# EAGLE design p128necontrol (EAGLE 9.6.2)
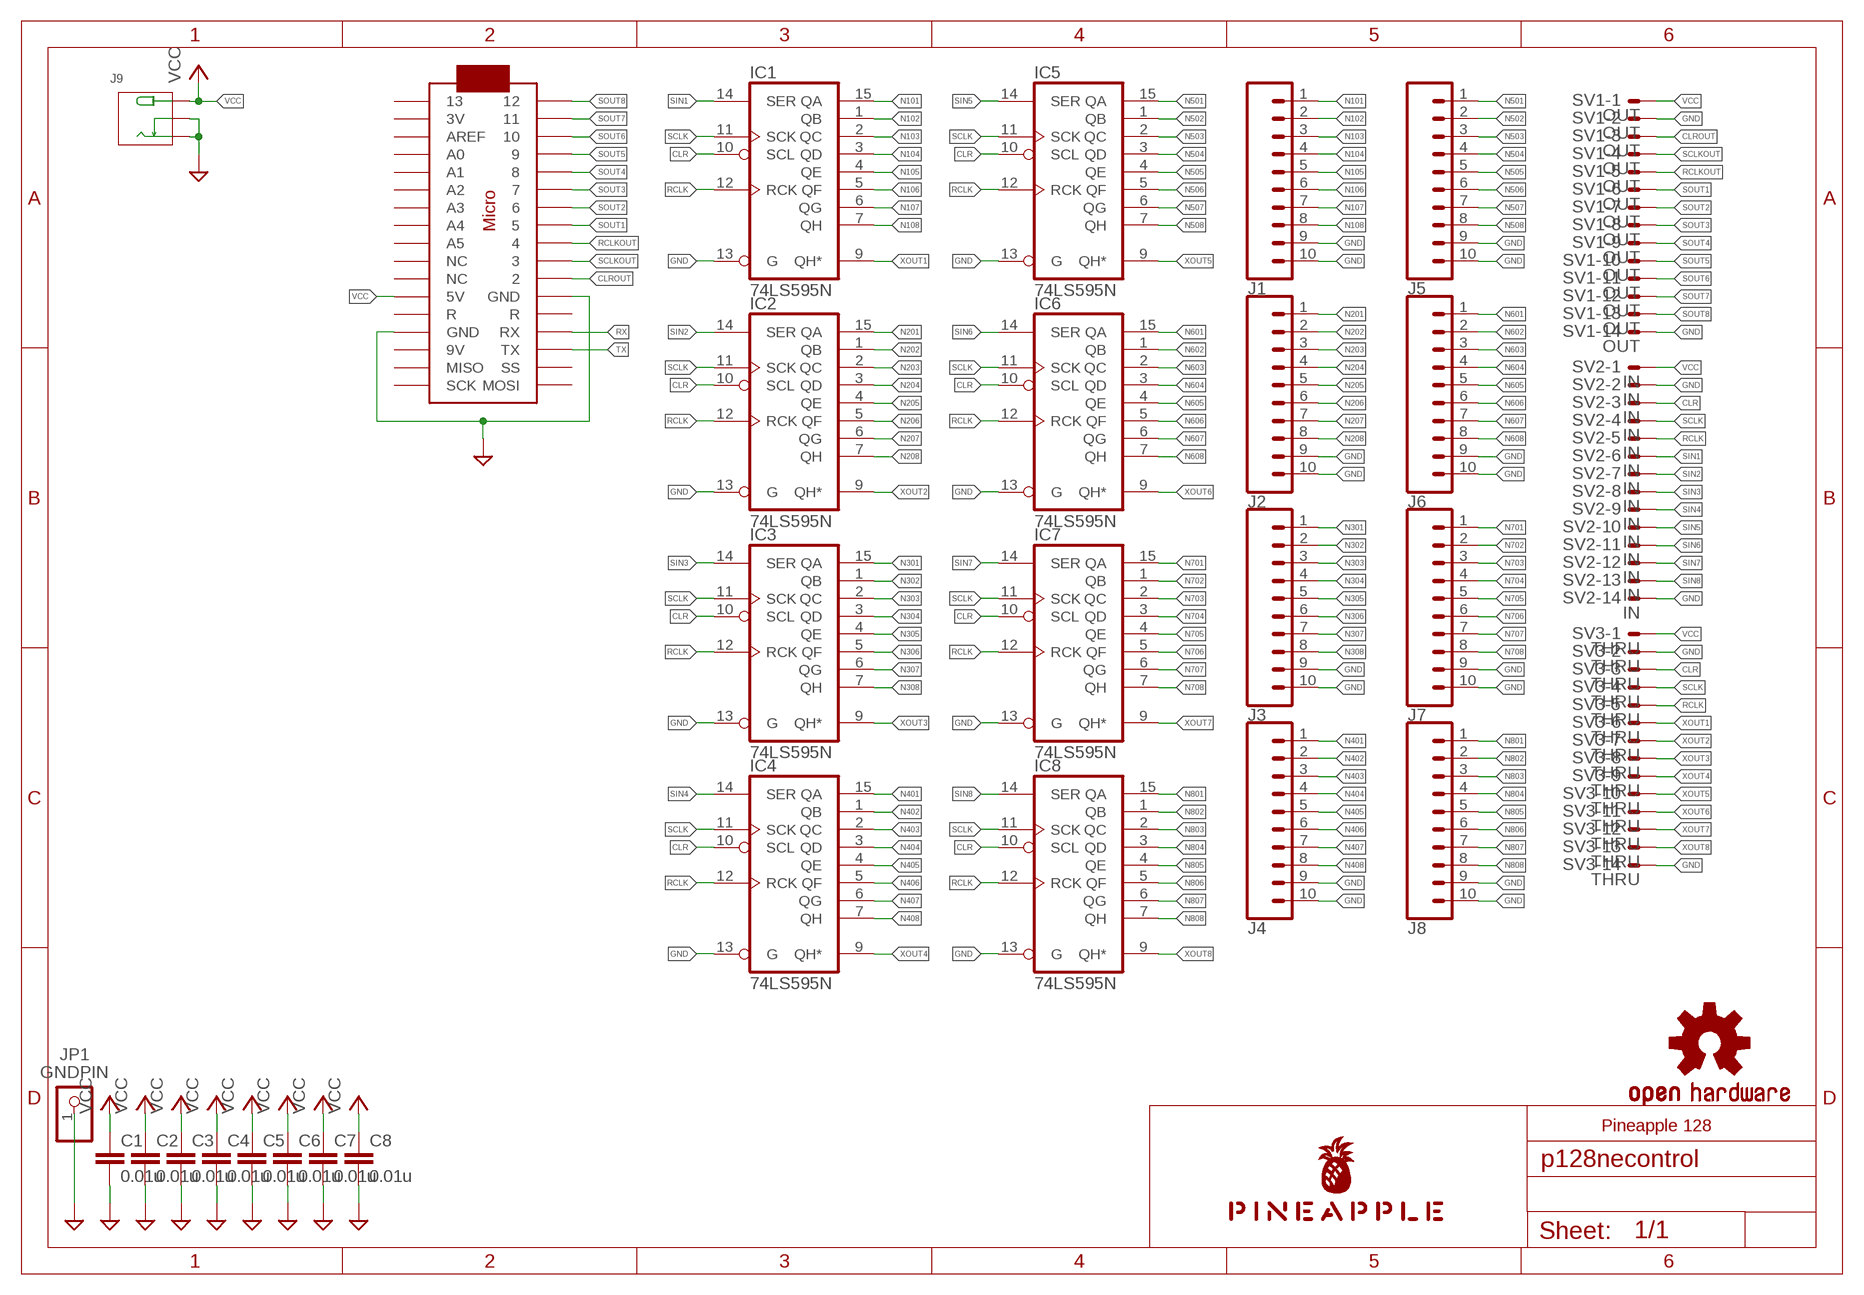
[diagram p0: schematic, sheet 1]

## Parts
C1  0.01u  C-EU025-024X044  [C025-024X044]
C2  0.01u  C-EU025-024X044  [C025-024X044]
C3  0.01u  C-EU025-024X044  [C025-024X044]
C4  0.01u  C-EU025-024X044  [C025-024X044]
C5  0.01u  C-EU025-024X044  [C025-024X044]
C6  0.01u  C-EU025-024X044  [C025-024X044]
C7  0.01u  C-EU025-024X044  [C025-024X044]
C8  0.01u  C-EU025-024X044  [C025-024X044]
IC1  74LS595N  [DIL16]
IC2  74LS595N  [DIL16]
IC3  74LS595N  [DIL16]
IC4  74LS595N  [DIL16]
IC5  74LS595N  [DIL16]
IC6  74LS595N  [DIL16]
IC7  74LS595N  [DIL16]
IC8  74LS595N  [DIL16]
J1  CONN_10"  [1X10]
J2  CONN_10"  [1X10]
J3  CONN_10"  [1X10]
J4  CONN_10"  [1X10]
J5  CONN_10"  [1X10]
J6  CONN_10"  [1X10]
J7  CONN_10"  [1X10]
J8  CONN_10"  [1X10]
J9  JACK-DC-005'DC-005'  [3P-L14.2*W11.0*H9.0MM]
JP1  GNDPIN  PINHD-1X1  [1X01]
LOGO1  OSHW-LOGOS-COPPER  [OSHW-LOGO-S_COPPER]
SV1  OUT  ML14E  [ML14]
SV2  IN  ML14E  [ML14]
SV3  THRU  ML14E  [ML14]
U$1  PINEAPPLE450_SILK  [PINEAPPLE450_SILK]
U$2  ARDUINOMICRO  [ARDUINOMICRO]

## Nets
CLR: IC1.10(SCL) IC2.10(SCL) IC3.10(SCL) IC4.10(SCL) IC5.10(SCL) IC6.10(SCL) IC7.10(SCL) IC8.10(SCL) SV2.3 SV3.3
CLROUT: SV1.3 U$2.P$11
GND [gnd]: C1.2 C2.2 C3.2 C4.2 C5.2 C6.2 C7.2 C8.2 IC1.13(G) IC2.13(G) IC3.13(G) IC4.13(G) IC5.13(G) IC6.13(G) IC7.13(G) IC8.13(G) J1.9 J1.10 J2.9 J2.10 J3.9 J3.10 J4.9 J4.10 J5.9 J5.10 J6.9 J6.10 J7.9 J7.10 J8.9 J8.10 J9.-1(-) J9.-2(CDN) JP1.1 SV1.2 SV1.14 SV2.2 SV2.14 SV3.2 SV3.14 U$2.P$12(GND) U$2.P$21(GND)
N101: IC1.15(QA) J1.1
N102: IC1.1(QB) J1.2
N103: IC1.2(QC) J1.3
N104: IC1.3(QD) J1.4
N105: IC1.4(QE) J1.5
N106: IC1.5(QF) J1.6
N107: IC1.6(QG) J1.7
N108: IC1.7(QH) J1.8
N201: IC2.15(QA) J2.1
N202: IC2.1(QB) J2.2
N203: IC2.2(QC) J2.3
N204: IC2.3(QD) J2.4
N205: IC2.4(QE) J2.5
N206: IC2.5(QF) J2.6
N207: IC2.6(QG) J2.7
N208: IC2.7(QH) J2.8
N301: IC3.15(QA) J3.1
N302: IC3.1(QB) J3.2
N303: IC3.2(QC) J3.3
N304: IC3.3(QD) J3.4
N305: IC3.4(QE) J3.5
N306: IC3.5(QF) J3.6
N307: IC3.6(QG) J3.7
N308: IC3.7(QH) J3.8
N401: IC4.15(QA) J4.1
N402: IC4.1(QB) J4.2
N403: IC4.2(QC) J4.3
N404: IC4.3(QD) J4.4
N405: IC4.4(QE) J4.5
N406: IC4.5(QF) J4.6
N407: IC4.6(QG) J4.7
N408: IC4.7(QH) J4.8
N501: IC5.15(QA) J5.1
N502: IC5.1(QB) J5.2
N503: IC5.2(QC) J5.3
N504: IC5.3(QD) J5.4
N505: IC5.4(QE) J5.5
N506: IC5.5(QF) J5.6
N507: IC5.6(QG) J5.7
N508: IC5.7(QH) J5.8
N601: IC6.15(QA) J6.1
N602: IC6.1(QB) J6.2
N603: IC6.2(QC) J6.3
N604: IC6.3(QD) J6.4
N605: IC6.4(QE) J6.5
N606: IC6.5(QF) J6.6
N607: IC6.6(QG) J6.7
N608: IC6.7(QH) J6.8
N701: IC7.15(QA) J7.1
N702: IC7.1(QB) J7.2
N703: IC7.2(QC) J7.3
N704: IC7.3(QD) J7.4
N705: IC7.4(QE) J7.5
N706: IC7.5(QF) J7.6
N707: IC7.6(QG) J7.7
N708: IC7.7(QH) J7.8
N801: IC8.15(QA) J8.1
N802: IC8.1(QB) J8.2
N803: IC8.2(QC) J8.3
N804: IC8.3(QD) J8.4
N805: IC8.4(QE) J8.5
N806: IC8.5(QF) J8.6
N807: IC8.6(QG) J8.7
N808: IC8.7(QH) J8.8
RCLK: IC1.12(RCK) IC2.12(RCK) IC3.12(RCK) IC4.12(RCK) IC5.12(RCK) IC6.12(RCK) IC7.12(RCK) IC8.12(RCK) SV2.5 SV3.5
RCLKOUT: SV1.5 U$2.P$9
RX: U$2.P$14(RX)
SCLK: IC1.11(SCK) IC2.11(SCK) IC3.11(SCK) IC4.11(SCK) IC5.11(SCK) IC6.11(SCK) IC7.11(SCK) IC8.11(SCK) SV2.4 SV3.4
SCLKOUT: SV1.4 U$2.P$10
SIN1: IC1.14(SER) SV2.6
SIN2: IC2.14(SER) SV2.7
SIN3: IC3.14(SER) SV2.8
SIN4: IC4.14(SER) SV2.9
SIN5: IC5.14(SER) SV2.10
SIN6: IC6.14(SER) SV2.11
SIN7: IC7.14(SER) SV2.12
SIN8: IC8.14(SER) SV2.13
SOUT1: SV1.6 U$2.P$8
SOUT2: SV1.7 U$2.P$7
SOUT3: SV1.8 U$2.P$6
SOUT4: SV1.9 U$2.P$5
SOUT5: SV1.10 U$2.P$4
SOUT6: SV1.11 U$2.P$3
SOUT7: SV1.12 U$2.P$2
SOUT8: SV1.13 U$2.P$1
TX: U$2.P$15(TX)
VCC [power]: C1.1 C2.1 C3.1 C4.1 C5.1 C6.1 C7.1 C8.1 J9.+ SV1.1 SV2.1 SV3.1 U$2.P$23(5V)
XOUT1: IC1.9(QH*) SV3.6
XOUT2: IC2.9(QH*) SV3.7
XOUT3: IC3.9(QH*) SV3.8
XOUT4: IC4.9(QH*) SV3.9
XOUT5: IC5.9(QH*) SV3.10
XOUT6: IC6.9(QH*) SV3.11
XOUT7: IC7.9(QH*) SV3.12
XOUT8: IC8.9(QH*) SV3.13
Unconnected: U$2.P$13(R) U$2.P$16(SS) U$2.P$17(MOSI) U$2.P$18(SCK) U$2.P$19(MISO) U$2.P$20(9V) U$2.P$22(R) U$2.P$24(NC) U$2.P$25(NC) U$2.P$26(A5) U$2.P$27(A4) U$2.P$28(A3) U$2.P$29(A2) U$2.P$30(A1) U$2.P$31(A0) U$2.P$32(AREF) U$2.P$33(3V) U$2.P$34

## Notes on the sheet
- Pineapple 128

## Power pins joined to a net without a drawn wire
GND: IC1.8(GND) IC2.8(GND) IC3.8(GND) IC4.8(GND) IC5.8(GND) IC6.8(GND) IC7.8(GND) IC8.8(GND)
VCC: IC1.16(VCC) IC2.16(VCC) IC3.16(VCC) IC4.16(VCC) IC5.16(VCC) IC6.16(VCC) IC7.16(VCC) IC8.16(VCC)

## Library data of the parts
C1-C8 = resistor:C-EU: CAPACITOR, European symbol
IC1-IC8 = 74xx-us:74*595: 8-bit SHIFT REGISTER, output latch
J1-J8 = SparkFun-Connectors:CONN_10: Multi connection point. Often used as Generic Header-pin footprint for 0.1 inch spaced/style header connections On any of the 0.1 inch spaced packages, you can populate with these: Break Away Headers - Straight <https://www.sparkfun.com/products/116> (PRT-00116) Break Away Male Headers - Right Angle <https://www.sparkfun.com/products/553> (PRT-00553) Female Headers <https://www.sparkfun.com/products/115> (PRT-00115) Break Away Headers - Machine Pin <https://www.sparkfun.com/products/117> (PRT-00117) Break Away Female Headers - Swiss Machine Pin <https://www.sparkfun.com/products/743> (PRT-00743) Arduino Stackable Header - 10 Pin <https://www.sparkfun.com/products/11376> (PRT-11376) For SCREWTERMINALS and SPRING TERMINALS visit here: Screw Terimnals on SparkFun.com <https://www.sparkfun.com/search/results?term=Screw+Terminals> (5mm/3.5mm/2.54mm spacing) This device is also useful as a general connection point to wire up your design to another part of your project. Our various solder wires solder well into these plated through hole pads. Hook-Up Wire - Assortment (Stranded, 22 AWG) <https://www.sparkfun.com/products/11375> (PRT-11375) Hook-Up Wire - Assortment (Solid Core, 22 AWG) <https://www.sparkfun.com/products/11367> (PRT-11367) View the entire wire category on our website here <https://www.sparkfun.com/categories/141> Special notes: Molex polarized connector foot print use with SKU : PRT-08231 with associated crimp pins and housings. 1MM SMD Version SKU: PRT-10208 NOTES ON THE VARIANTS LOCK and LOCK_LONGPADS... This footprint was designed to help hold the alignment of a through-hole component (i.e. 6-pin header) while soldering it into place. You may notice that each hole has been shifted either up or down by 0.005 of an inch from it's more standard position (which is a perfectly straight line). This slight alteration caused the pins (the squares in the middle) to touch the edges of the holes. Because they are alternating, it causes a "brace" to hold the component in place. 0.005 has proven to be the perfect amount of "off-center" position when using our standard breakaway headers. Although looks a little odd when you look at the bare footprint, once you have a header in there, the alteration is very hard to notice. Also,if you push a header all the way into place, it is covered up entirely on the bottom side.; PROD_ID: CONN-11563
J9 = Seeed-Connector:JACK-DC-005: 320120003
JP1 = pinhead:PINHD-1X1: PIN HEADER
LOGO1 = SparkFun-Aesthetics:OSHW-LOGO: Open-Source Hardware (OSHW) Logo This logo indicates the piece of hardware it is found on incorporates a OSHW license and/or adheres to the definition of open source hardware found here: http://freedomdefined.org/OSHW
SV1-SV3 = con-ml:ML14E: HARTING; OC_FARNELL: unknown; OC_NEWARK: unknown
U$1 = pineapple:PINEAPPLE450_SILK
U$2 = adafruit:ARDUINOMICRO

## Net classes
0 default: width 0.152 mm, drill 0.152 mm, clearance 0.152 mm
1 gnd: width 0.305 mm, drill 0.152 mm, clearance 0.152 mm
2 power: width 0.305 mm, drill 0.152 mm, clearance 0.152 mm
3 analog: width 0.152 mm, drill 0.152 mm, clearance 0.152 mm

## Board
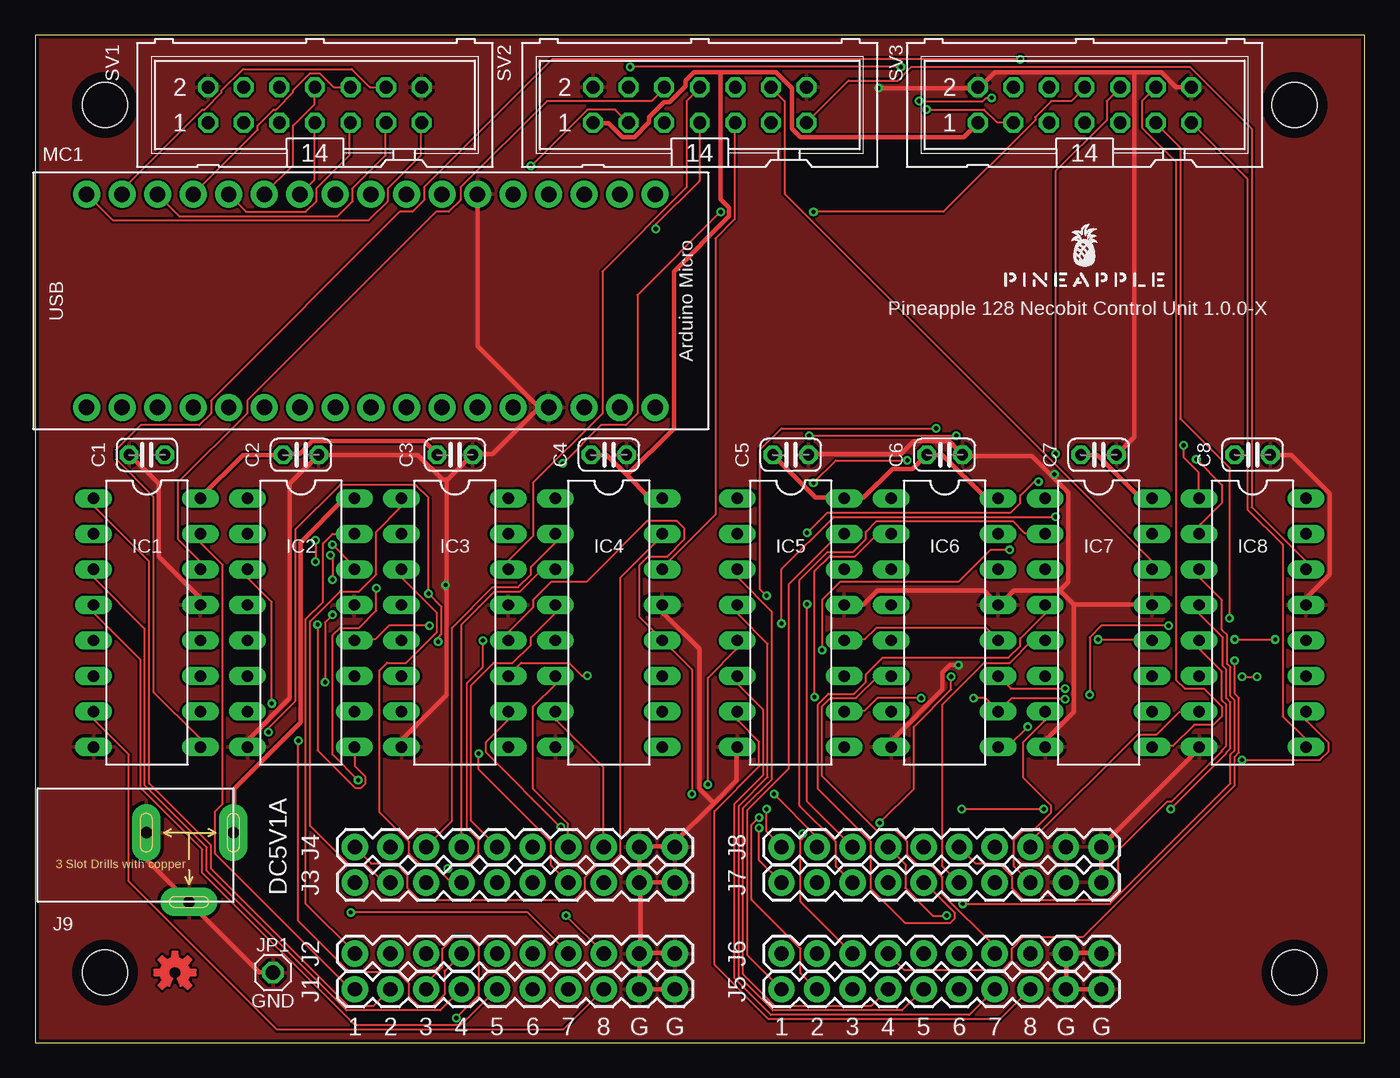
[diagram p1: board, top side]
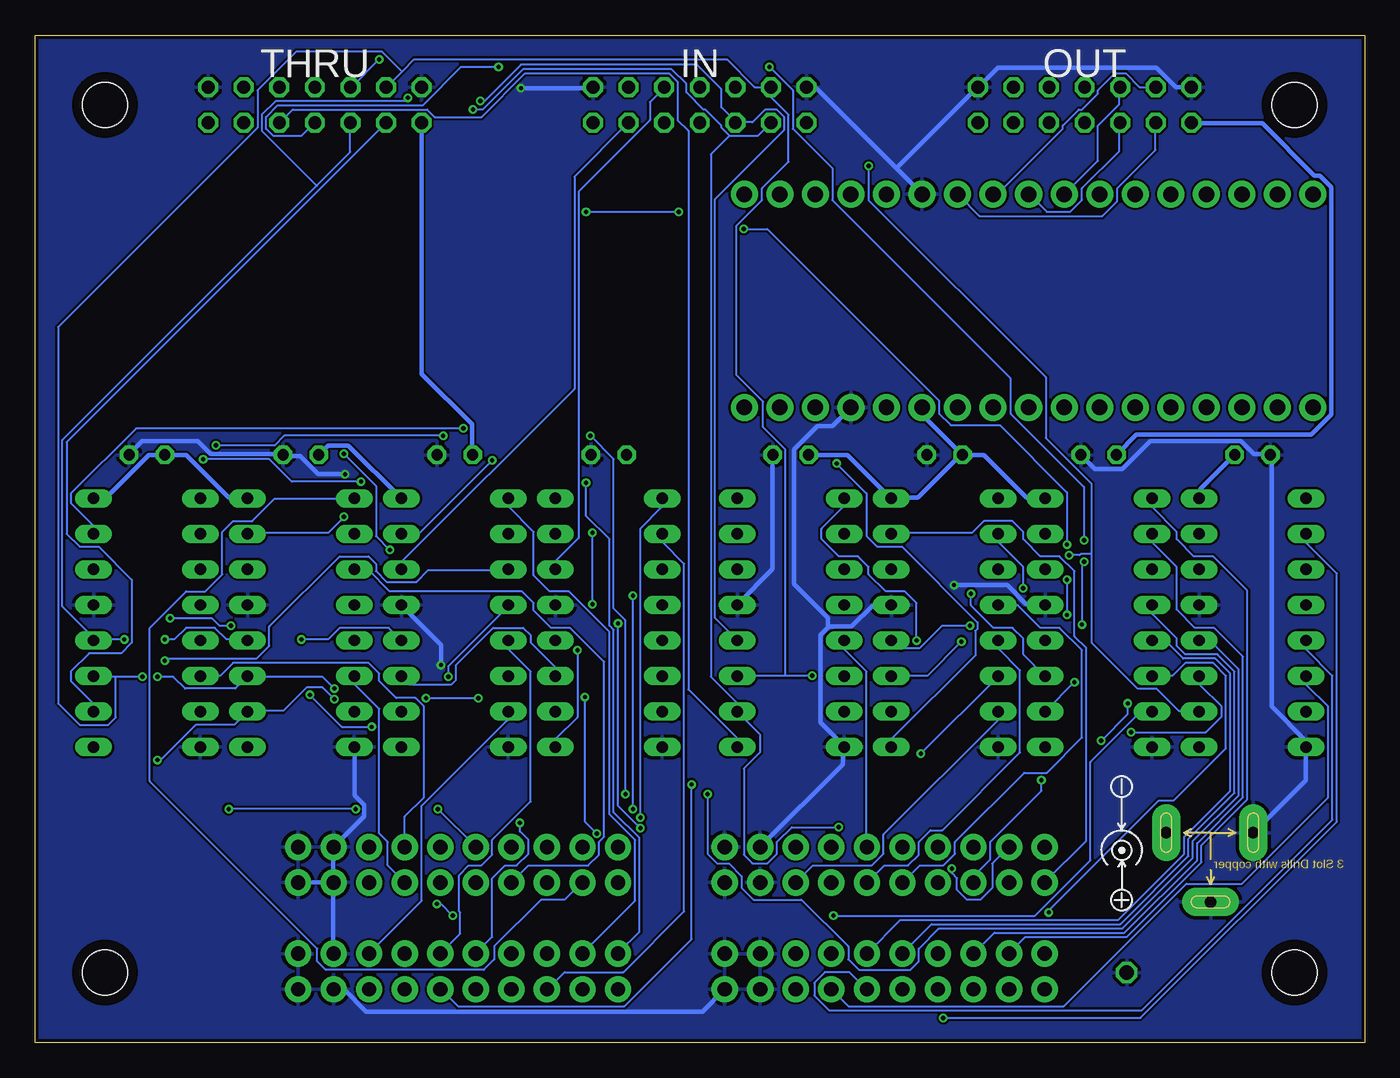
[diagram p2: board, bottom side, seen from below]

Size 95 x 72 mm. Coordinates in mm from the lower left corner, seen from the top.
Outline: 0,0 95,0 95,72 0,72 0,0
Copper layers (1*16): Top 0.035mm / dielectric 1.5mm / Bottom 0.035mm
Design rules "SeeedStudio_2layer_DRU_no_angle_20140221": minimum track width 6mil, minimum drill 12mil, track to track 6mil, track to pad 6mil, pad to pad 6mil, via to via 6mil, smd to smd 0mil, copper to edge 10mil, drill to drill 10mil, minimum pad ring 10mil, minimum via ring 6mil, stop-mask expansion 2mil, vias tented up to drill 100mil, thermal gap 10mil
Holes 3.2 mm at 5,5 90,5 90,67 5,67
tRestrict: area 2.8,64.8 to 7.2,69.2; area 87.8,64.8 to 92.2,69.2; area 2.8,2.8 to 7.2,7.2; area 87.8,2.8 to 92.2,7.2
bRestrict: area 2.8,2.8 to 7.2,7.2; area 87.8,2.8 to 92.2,7.2; area 87.8,64.8 to 92.2,69.2; area 2.8,64.8 to 7.2,69.2

### Footprints (pad centres in the part's own frame; a part is rotated, then mirrored left to right if it is on the bottom)
C025-024X044 = drill 0.813 octagon: 1 -1.27,0; 2 1.27,0
DIL16 = drill 0.813 long: 1 -8.89,-3.81; 2 -6.35,-3.81; 3 -3.81,-3.81; 4 -1.27,-3.81; 5 1.27,-3.81; 6 3.81,-3.81; 7 6.35,-3.81; 8 8.89,-3.81; 9 8.89,3.81; 10 6.35,3.81; 11 3.81,3.81; 12 1.27,3.81; 13 -1.27,3.81; 14 -3.81,3.81; 15 -6.35,3.81; 16 -8.89,3.81
1X10 = drill 1.016 pad 1.88: 1 0,0; 2 2.54,0; 3 5.08,0; 4 7.62,0; 5 10.16,0; 6 12.7,0; 7 15.24,0; 8 17.78,0; 9 20.32,0; 10 22.86,0
3P-L14.2*W11.0*H9.0MM = drill 0.813 pad 2.032 long: + 3.175,0; -1 -3.048,0; -2 0,-4.953
1X01 = drill 1.016 octagon: 1 0,0
ML14 = drill 0.914 octagon: 1 -7.62,-1.27; 2 -7.62,1.27; 3 -5.08,-1.27; 4 -5.08,1.27; 5 -2.54,-1.27; 6 -2.54,1.27; 7 0,-1.27; 8 0,1.27; 9 2.54,-1.27; 10 2.54,1.27; 11 5.08,-1.27; 12 5.08,1.27; 13 7.62,-1.27; 14 7.62,1.27
ARDUINOMICRO = drill 1.1 pad 1.93: P$1 -20.32,7.62; P$2 -17.78,7.62; P$3 -15.24,7.62; P$4 -12.7,7.62; P$5 -10.16,7.62; P$6 -7.62,7.62; P$7 -5.08,7.62; P$8 -2.54,7.62; P$9 0,7.62; P$10 2.54,7.62; P$11 5.08,7.62; P$12 12.7,-7.62; P$13 10.16,-7.62; P$14 12.7,7.62; P$15 15.24,7.62; P$16 17.78,7.62; P$17 20.32,7.62; P$18 20.32,-7.62; P$19 17.78,-7.62; P$20 15.24,-7.62; P$21 7.62,7.62; P$22 10.16,7.62; P$23 7.62,-7.62; P$24 5.08,-7.62; P$25 2.54,-7.62; P$26 0,-7.62; P$27 -2.54,-7.62; P$28 -5.08,-7.62; P$29 -7.62,-7.62; P$30 -10.16,-7.62; P$31 -12.7,-7.62; P$32 -15.24,-7.62; P$33 -17.78,-7.62; P$34 -20.32,-7.62

### Placement (x,y rotation side)
C1  8,42 180 top
C2  19,42 0 top
C3  30,42 0 top
C4  41,42 0 top
C5  54,42 0 top
C6  65,42 0 top
C7  76,42 0 top
C8  87,42 0 top
IC1  8,30 270 top
IC2  19,30 270 top
IC3  30,30 270 top
IC4  41,30 270 top
IC5  54,30 270 top
IC6  65,30 270 top
IC7  76,30 270 top
IC8  87,30 270 top
J1  22.86,3.81 0 top
J2  22.86,6.35 0 top
J3  22.86,11.43 0 top
J4  22.86,13.97 0 top
J5  53.34,3.81 0 top
J6  53.34,6.35 0 top
J7  53.34,11.43 0 top
J8  53.34,13.97 0 top
J9  11,15 0 top
JP1  17,5 0 top
LOGO1  10,5 0 top
SV1  20,67 0 top
SV2  47.5,67 0 top
SV3  75,67 0 top
U$1  75,54 0 top
U$2  24,53 0 top

### Tracks (layer width: path | path; a pad name or v marks a point on that pad's centre or on a via)
CLR  (via drill 0.3)
  Top 0.152: v63.32,24.61 60.2,24.61 59.28,23.7 57.84,23.7 IC5.10 | v67.06,24.61 67.89,24.61 68.81,23.7 IC6.10 68.89,23.7 69.8,24.61 73.15,24.61 73.23,24.54 v73.61,24.54 | v86.26,20.19 91.82,20.19 92.43,20.8 92.43,21.41 90.83,23.01 90.83,23.62 IC8.10 | v37.57,15.39 32.23,20.73 32.23,21.49 33.76,23.01 33.76,23.62 IC3.10 | v35.43,62.64 39.47,66.67 41.45,66.67 42.37,65.76 SV2.3 | v20.73,25.76 20.73,30.02 v21.26,30.56 | v21.26,33.07 21.26,34.67 v21.11,34.82 | v63.7,66.67 67.82,66.67 68.73,65.76 69.88,65.76 SV3.3
  Bottom 0.152: v67.06,24.61 v63.32,24.61 | v73.61,24.54 74.45,25.38 75.59,25.38 77.27,23.7 79.78,23.7 IC7.10 79.86,23.62 80.77,22.71 83.52,22.71 86.03,20.19 v86.26,20.19 | v37.57,15.39 40.92,15.39 41.99,14.33 41.99,13.49 42.67,12.8 43.74,12.8 44.35,13.41 44.35,19.58 43.2,20.73 43.2,22.02 44.81,23.62 IC4.10 44.88,23.7 44.88,24.31 46.71,26.14 46.71,63.48 45.38,64.81 | 19.51,34.9 19.51,39.93 22.78,43.2 22.78,47.55 35.43,60.2 v35.43,62.64 | 19.51,34.9 19.51,28.57 16.23,25.3 14.86,25.3 13.26,23.7 11.81,23.7 IC1.10 | v20.73,25.76 22.78,23.7 IC2.10 | v21.26,33.07 v21.26,30.56 | v21.11,34.82 20.34,34.82 20.27,34.9 19.51,34.9 | v63.7,66.67 63.02,66.67 60.12,69.57 49.53,69.57 48.46,68.5 48.46,67.89 47.24,66.67 47.09,66.67 45.95,65.53 45.95,65.38 45.38,64.81 | 45.38,64.81 45.34,64.77 43.36,64.77 42.44,65.68 SV2.3 | IC8.10 90.83,23.7 90.83,24.23 92.43,25.83 92.43,26.52 91.14,27.81 88.85,27.81 88.09,28.57 88.09,33.07 90.45,35.43 91.82,35.43 92.73,36.35 92.73,42.9 69.95,65.68 SV3.3
CLROUT
  Bottom 0.152: SV1.3 14.94,65.68 14.94,63.78 17.68,61.04 17.68,60.12 18.75,59.05 27.51,59.05 29.03,60.58 U$2.P$11
GND  (via drill 0.3)
  Top 0.305: IC8.8 83.13,21.11 83.13,20.95 76.2,14.02 J8.10 J7.10 | J5.10 J5.9 73.69,3.81 73.69,6.33 J6.9 73.76,6.4 76.2,6.4 J6.10 | v60.27,68.2 67.36,68.2 SV3.2 67.51,68.28 68.58,69.34 78.56,69.34 | 78.56,69.34 80.47,69.34 81.53,68.28 82.6,68.28 SV3.14 | IC8.13 90.83,31.32 90.83,31.77 92.51,33.45 92.51,39.24 89.76,41.99 88.32,41.99 C8.2 | C5.2 55.32,42.06 61.87,42.06 62.79,42.98 65.3,42.98 66.22,42.06 C6.2 66.37,41.91 71.25,41.91 72.69,40.46 | v65.99,26.98 65.38,26.98 64.85,26.44 64.85,25.22 61.27,21.64 61.27,21.18 IC6.8 | IC5.13 57.84,31.32 59.21,31.32 60.2,32.31 67.82,32.31 68.81,31.32 IC6.13 68.96,31.32 69.95,32.31 73.23,32.31 | 74.22,31.32 79.78,31.32 IC7.13 | 73.23,32.31 74.22,31.32 | 72.69,40.46 73.84,39.32 73.84,32.92 73.23,32.31 | v72.85,40.62 72.69,40.46 | 78.56,69.34 78.56,43.28 77.34,42.06 C7.2 | 74.22,31.32 74.22,23.62 72.24,21.64 72.24,21.18 IC7.8 | 48.5,17.11 45.72,14.33 J4.10 45.64,14.02 43.28,14.02 J4.9 43.2,13.95 43.2,11.43 J3.9 | 48.5,17.11 50.14,18.75 50.14,21.11 IC5.8 | 48.5,17.11 47.47,18.14 47.47,28.12 44.88,30.71 44.88,31.24 IC4.13 | J2.9 43.2,6.33 43.2,3.81 J1.9 J1.10 | J2.10 45.72,6.4 43.28,6.4 J2.9 | J3.9 J3.10 | J2.9 43.28,6.55 43.28,11.35 J3.9 | JP1.1 16.99,5.03 16,5.03 11.05,9.98 J9.-2 10.9,10.13 8,13.03 8,14.94 J9.-1 | IC1.13 11.73,31.32 11.73,31.85 8.84,34.75 8.84,39.93 6.78,41.99 C1.2 | IC2.8 15.24,21.18 15.24,21.64 18.21,24.61 18.21,39.93 20.27,41.99 C2.2 20.42,41.99 27.36,41.99 29.11,40.23 29.34,40.23 29.41,40.16 | 29.41,40.16 29.41,32.69 | 29.41,32.69 29.41,24.84 26.21,21.64 26.21,21.18 IC3.8 | 29.41,40.16 31.24,41.99 C3.2 31.39,42.06 32.69,42.06 35.97,45.34 36.65,45.34 U$2.P$12 35.97,45.41 31.62,49.76 31.62,60.58 U$2.P$21
  Top 0.305: v29.34,32.69 29.41,32.69
  Bottom 0.305: IC7.8 72.16,21.11 72.16,17.68 71.48,16.99 71.48,16.15 J8.9 73.69,13.87 73.69,11.43 J7.9 | J6.9 73.69,6.4 73.69,11.35 J7.9 | J7.9 J7.10 | v60.27,68.2 55.17,68.2 SV2.14 | C8.2 88.24,42.06 87.33,42.98 83.36,42.98 82.45,42.06 77.34,42.06 C7.2 77.19,41.91 76.05,41.91 74.75,40.62 v72.85,40.62 | v65.99,26.98 65.99,28.42 68.81,31.24 IC6.13 | C4.2 42.29,41.99 42.29,33.83 44.81,31.32 IC4.13 | J4.9 37.26,19.89 37.26,21.11 IC4.8 37.26,21.26 38.86,22.86 38.86,29.11 38.25,29.72 | 38.25,29.72 36.65,29.72 35.13,31.24 33.83,31.24 IC3.13 | J9.-1 7.92,15.01 4.19,18.75 IC1.8 4.19,21.26 4.19,21.57 6.63,24 6.63,41.91 C1.2 6.78,42.06 7.92,42.06 8.84,42.98 15.32,42.98 17.3,41 19.28,41 20.27,41.99 C2.2 | SV1.2 12.42,68.28 13.49,68.28 14.86,69.65 26.21,69.65 27.58,68.28 SV1.14 27.74,68.2 33.45,62.48 | 33.45,62.48 31.62,60.66 U$2.P$21 | 33.45,62.48 39.17,68.2 39.85,68.2 SV2.2 | v29.34,32.69 25.53,32.69 24.16,31.32 22.86,31.32 IC2.13 | 38.25,29.72 38.33,29.79 38.33,30.33 40.77,32.77 40.77,42.37 39.09,44.04 38.02,44.04 36.73,45.34 U$2.P$12 | J5.9 72.92,3.81 71.32,2.21 47.32,2.21 J1.10
  pour Top: -1,-1 96,-1 96,73 -1,73
  pour Bottom: -2,-2 97,-2 97,74 -2,74
N101
  Top 0.152: J1.1 22.55,3.81 12.88,13.49 12.88,16.54 13.41,17.07 13.41,34.14 11.81,35.74 IC1.15
N102
  Top 0.152: IC1.1 4.19,38.86 4.19,38.33 8.15,34.37 8.15,18.52 12.57,14.1 12.57,12.42 22.4,2.59 24.16,2.59 25.38,3.81 J1.2
N103  (via drill 0.3)
  Top 0.152: v30.1,1.75 31.7,3.35 31.7,6.86 31.01,7.54 29.95,7.54 29.11,6.71 29.11,5.41 27.96,4.27 27.96,3.81 J1.3
  Bottom 0.152: v30.1,1.75 16,1.75 1.98,15.77 1.98,33.53 4.12,35.66 4.12,36.35 IC1.2
N104
  Top 0.152: J1.4 28.96,2.29 22.25,2.29 12.27,12.27 12.27,13.95 7.85,18.36 7.85,29.57 4.19,33.22 4.19,33.76 IC1.3
N105
  Top 0.152: IC1.4 4.19,31.24 4.19,30.71 7.54,27.36 7.54,18.21 11.96,13.79 11.96,12.12 22.86,1.22 30.4,1.22 32.99,3.81 J1.5
N106
  Bottom 0.152: IC1.5 4.12,28.73 4.12,28.04 2.29,26.21 2.29,15.93 15.93,2.29 38.25,2.29 39.32,3.35 39.32,4.27 38.56,5.03 36.8,5.03 35.59,3.81 J1.6
N107
  Bottom 0.152: J1.7 36.88,2.59 21.49,2.59 12.72,11.35 8.76,11.35 2.59,17.53 2.59,24 4.12,25.53 4.12,26.14 IC1.6
N108
  Top 0.152: IC1.7 4.19,23.62 4.19,23.09 6.71,20.57 6.71,11.51 17.3,0.91 37.72,0.91 40.62,3.81 J1.8
N201
  Top 0.152: IC2.15 22.78,36.35 21.26,36.35 20.57,35.66 20.57,31.47 19.36,30.25 19.36,9.91 22.86,6.4 J2.1
N202
  Bottom 0.152: IC2.1 15.16,38.86 15.16,38.25 13.41,36.5 13.41,35.97 12.19,34.75 10.82,34.75 8.38,32.31 8.38,17.37 11.66,14.1 11.66,12.88 16.99,7.54 24.23,7.54 25.38,6.4 J2.2
N203
  Bottom 0.152: J2.3 26.44,7.85 17.14,7.85 11.96,13.03 11.96,14.25 8.69,17.53 8.69,27.58 10.74,29.64 12.12,29.64 13.41,30.94 13.41,33.98 15.16,35.74 15.16,36.35 IC2.2
N204  (via drill 0.3)
  Top 0.152: v16.92,24.23 16.92,31.47 15.24,33.15 15.24,33.76 IC2.3 | v18.82,21.57 18.82,8.69 22.48,5.03 25.91,5.03 26.75,4.19 26.75,3.28 27.43,2.59 28.42,2.59 29.26,3.43 29.26,5.11 30.48,6.33 J2.4
  Bottom 0.152: v16.92,24.23 16.92,23.47 v18.82,21.57
N205
  Bottom 0.152: IC2.4 15.16,31.24 15.16,30.63 13.41,28.88 13.41,28.35 12.8,27.74 10.52,27.74 9.3,26.52 9.3,17.83 12.57,14.55 12.57,13.34 17.45,8.46 30.94,8.46 32.99,6.4 J2.5
N206
  Bottom 0.152: J2.6 33.15,8.76 17.6,8.76 12.88,13.49 12.88,14.71 9.6,17.98 9.6,26.36 10.67,27.43 12.95,27.43 14.25,28.73 15.16,28.73 IC2.5
N207  (via drill 0.3)
  Top 0.152: v22.55,9.3 35.2,9.3 38.1,6.4 J2.7
  Bottom 0.152: v22.55,9.3 22.55,9.45 14.71,17.3 13.64,17.3 9.91,21.03 9.91,26.21 10.82,27.13 12.8,27.13 13.72,26.21 15.16,26.21 IC2.6
N208  (via drill 0.3)
  Top 0.152: v37.95,9.07 40.62,6.4 J2.8
  Bottom 0.152: v37.95,9.07 23.55,9.07 19.58,13.03 19.58,20.04 16,23.62 15.24,23.62 IC2.7
N301
  Bottom 0.152: J3.1 19.89,14.4 19.89,28.19 20.73,29.03 20.73,33.68 21.79,34.75 23.16,34.75 24.38,35.97 24.38,36.5 25.15,37.26 27.2,37.26 28.04,36.42 33.76,36.42 IC3.15
N302
  Top 0.152: J3.2 24.92,11.43 23.7,12.65 22.48,12.65 19.66,15.47 19.66,30.1 21.79,32.23 23.16,32.23 24.38,33.45 24.38,36.5 26.14,38.25 26.14,38.86 IC3.1
N303  (via drill 0.3)
  Top 0.152: v24.38,32.46 24.38,30.86 23.16,29.64 21.79,29.64 21.26,29.11 21.26,20.57 v23.09,18.75
  Bottom 0.152: v24.38,32.46 24.38,33.98 26.14,35.74 26.14,36.35 IC3.2 | v23.09,18.75 23.09,17.98 26.75,14.33 26.75,13.11 27.89,11.96 27.89,11.43 J3.3
N304
  Top 0.152: J3.4 29.72,11.43 28.5,12.65 27.58,12.65 26.75,13.49 26.75,14.33 24.61,16.46 24.61,26.59 25.15,27.13 26.52,27.13 28.73,29.34 28.73,30.71 26.21,33.22 26.21,33.76 IC3.3
N305
  Bottom 0.152: IC3.4 26.14,31.24 24.77,31.24 23.16,29.64 21.79,29.64 20.19,28.04 20.19,21.79 22.71,19.28 24.31,19.28 29.26,14.33 29.26,13.49 30.1,12.65 31.77,12.65 32.99,11.43 J3.5
N306
  Bottom 0.152: IC3.5 26.14,28.73 26.14,28.12 24.61,26.59 24.61,20.73 30.18,15.16 31.01,15.16 31.85,14.33 31.85,13.41 32.61,12.65 34.29,12.65 35.51,11.43 J3.6
N307  (via drill 0.3)
  Top 0.152: v31.7,20.65 31.7,19.51 36.88,14.33 36.88,12.65 J3.7
  Bottom 0.152: v31.7,20.65 26.21,26.14 IC3.6
N308
  Bottom 0.152: IC3.7 26.21,23.62 26.21,23.01 34.37,14.86 34.37,13.49 35.2,12.65 39.4,12.65 40.62,11.43 J3.8
N401
  Top 0.152: IC4.15 44.81,36.2 41.83,33.22 41.83,13.49 41,12.65 40.16,12.65 39.32,11.81 39.32,10.97 38.56,10.21 27.43,10.21 26.59,11.05 26.59,11.96 25.76,12.8 24,12.8 22.86,13.95 J4.1
N402  (via drill 0.3)
  Top 0.152: v32,28.73 32,26.82 30.86,25.68 30.86,15.32 31.7,14.48 31.7,13.49 30.86,12.65 29.72,12.65 v29.49,12.42
  Bottom 0.152: v32,28.73 32,31.39 32.84,32.23 34.21,32.23 35.43,33.45 35.43,33.98 36.2,34.75 37.57,34.75 38.79,35.97 38.79,36.73 37.26,38.25 37.26,38.86 IC4.1 | v29.49,12.42 29.49,12.12 29.11,11.73 29.11,10.9 28.42,10.21 27.43,10.21 26.59,11.05 26.59,12.8 25.45,13.95 J4.2
N403
  Top 0.152: IC4.2 37.19,35.74 35.43,33.98 35.43,33.45 34.52,32.54 32.69,32.54 29.79,29.64 29.79,15.85 27.96,14.02 J4.3
N404
  Top 0.152: J4.4 30.48,29.87 32.84,32.23 34.67,32.23 36.2,33.76 37.19,33.76 IC4.3
N405
  Top 0.152: IC4.4 37.19,31.24 37.19,30.71 35.43,28.96 35.43,28.42 34.14,27.13 32.77,27.13 31.17,25.53 31.17,15.85 32.99,14.02 J4.5
N406
  Bottom 0.152: IC4.5 37.19,28.12 35.59,26.52 35.59,14.02 J4.6
N407
  Top 0.152: J4.7 38.1,15.62 35.59,18.14 35.59,24 37.19,25.6 37.19,26.14 IC4.6
N408
  Top 0.152: IC4.7 37.26,23.62 37.26,23.01 40.62,19.66 40.62,14.02 J4.8
N501
  Top 0.152: J5.1 50.9,6.25 50.9,16.61 53.87,19.58 53.87,32.77 57.45,36.35 57.76,36.35 IC5.15
N502  (via drill 0.3)
  Top 0.152: v51.74,16.08 51.21,15.54 51.21,10.21 54.71,6.71 54.71,4.95 55.85,3.81 J5.2
  Bottom 0.152: v51.74,16.08 51.74,36.73 50.22,38.25 50.22,38.86 IC5.1
N503
  Bottom 0.152: IC5.2 50.14,36.35 50.14,35.74 48.62,34.21 48.62,9.37 52.96,5.03 57.15,5.03 58.37,3.81 J5.3
N504
  Top 0.152: J5.4 59.74,2.59 52.88,2.59 50.6,4.88 50.6,16.76 52.65,18.82 52.65,30.79 50.22,33.22 50.22,33.76 IC5.3
N505
  Top 0.152: IC5.4 50.22,31.24 50.22,30.63 52.35,28.5 52.35,18.97 50.29,16.92 50.29,4.72 52.73,2.29 61.95,2.29 63.48,3.81 J5.5
N506  (via drill 0.3)
  Top 0.152: v48.08,18.44 48.08,26.06 50.14,28.12 50.14,28.73 IC5.5
  Bottom 0.152: v48.08,18.44 48.08,7.39 52.88,2.59 64.77,2.59 65.99,3.81 J5.6
N507
  Top 0.152: J5.7 66.75,1.98 52.58,1.98 49.99,4.57 49.99,17.07 52.05,19.13 52.05,23.77 50.22,25.6 50.22,26.14 IC5.6
N508
  Top 0.152: IC5.7 50.22,23.62 50.22,23.01 51.74,21.49 51.74,19.74 48.54,16.54 48.54,5.56 52.43,1.68 68.96,1.68 71.09,3.81 J5.8
N601  (via drill 0.3)
  Top 0.152: v62.33,41.6 57.23,41.6 v55.63,40.01
  Bottom 0.152: v62.33,41.6 67.51,36.42 68.81,36.42 IC6.15 | v55.63,40.01 55.63,37.64 53.95,35.97 53.95,29.79 53.65,29.49 53.65,16.46 51.82,14.63 51.82,7.92 53.34,6.4 J6.1
N602
  Bottom 0.152: IC6.1 61.19,38.86 61.19,38.33 59.36,36.5 59.36,33.38 58.22,32.23 56.84,32.23 53.95,29.34 53.95,16.31 52.12,14.48 52.12,10.13 55.85,6.4 J6.2
N603  (via drill 0.3)
  Top 0.152: v55.7,24.69 55.7,33.68 56.77,34.75 58.6,34.75 60.2,36.35 IC6.2 | v54.86,14.94 54.86,14.63 54.71,14.48 54.71,10.06 J6.3
  Bottom 0.152: v55.7,24.69 55.7,15.77 v54.86,14.94
N604  (via drill 0.3)
  Top 0.152: v85.72,27.28 85.72,24.92 86.03,24.61 86.03,20.73 85.72,20.42 85.72,18.36 74.91,7.54 70.64,7.54 69.8,6.71 69.8,5.87 69.11,5.18 62.1,5.18 60.96,6.33 J6.4
  Bottom 0.152: v85.72,27.28 85.57,27.43 79.17,27.43 78.26,28.35 78.26,29.72 73.23,34.75 71.17,34.75 70.64,34.21 70.64,33.68 69.88,32.92 67.74,32.92 66.9,33.76 61.27,33.76 IC6.3
N605  (via drill 0.3)
  Top 0.152: v65.46,26.14 65.46,25.22 62.79,22.55 62.79,18.14 v60.35,15.7
  Bottom 0.152: v65.46,26.14 65.46,26.9 61.27,31.09 61.27,31.24 IC6.4 | v60.35,15.7 60.35,15.09 59.74,14.48 59.74,13.49 60.58,12.65 61.42,12.65 62.33,11.73 62.33,7.54 63.48,6.4 J6.5
N606
  Bottom 0.152: J6.6 64.62,7.77 64.62,9.3 64.69,9.37 64.69,11.96 64.01,12.65 63.09,12.65 62.33,13.41 62.33,14.48 59.59,17.22 59.59,26.52 61.19,28.12 IC6.5
N607
  Top 0.152: J6.7 68.58,6.86 64.85,10.59 64.85,11.81 64.01,12.65 63.09,12.65 62.33,13.41 62.33,14.33 61.49,15.16 60.12,15.16 56.24,19.05 56.24,24 56.84,24.61 58.67,24.61 60.2,26.14 61.19,26.14 IC6.6
N608
  Bottom 0.152: IC6.7 61.27,23.62 61.27,23.01 67.36,16.92 67.36,10.13 71.09,6.4 J6.8
N701  (via drill 0.3)
  Top 0.152: v72.92,37.57 57.07,37.57 53.34,33.83 v53.34,29.95 | v51.74,15.32 51.74,13.03 J7.1
  Bottom 0.152: v72.92,37.57 74.07,36.42 79.78,36.42 IC7.15 | v53.34,29.95 53.34,16.92 v51.74,15.32
N702
  Bottom 0.152: IC7.1 72.24,38.86 77.88,38.86 79.48,37.26 80.85,37.26 81.61,36.5 81.61,33.45 82.83,32.23 84.2,32.23 86.79,29.64 86.79,18.67 74.83,6.71 74.83,5.79 74.22,5.18 62.94,5.18 62.18,5.94 62.18,6.86 58.83,10.21 57.15,10.21 55.93,11.43 J7.2
N703
  Top 0.152: IC7.2 72.16,36.42 70.71,36.42 69.88,37.26 60.12,37.26 59.36,36.5 59.36,35.97 58.45,35.05 56.62,35.05 54.63,33.07 54.63,16.92 57.23,14.33 57.23,12.57 58.37,11.43 J7.3
N704
  Bottom 0.152: J7.4 59.74,12.65 55.47,12.65 54.71,13.41 54.71,14.33 54.33,14.71 54.33,27.2 56.77,29.64 58.14,29.64 59.36,30.86 59.36,31.39 60.2,32.23 69.65,32.23 71.17,33.76 72.16,33.76 IC7.3
N705
  Top 0.152: IC7.4 72.16,31.24 72.16,30.63 70.41,28.88 70.41,28.35 69.57,27.51 60.58,27.51 59.36,26.29 59.36,25.76 58.52,24.92 56.69,24.92 55.93,24.16 55.93,18.14 59.74,14.33 59.74,10.97 62.18,8.53 65.38,8.53 65.68,8.84 65.68,9.3 63.55,11.43 J7.5
N706
  Top 0.152: IC7.5 72.16,28.73 71.25,28.73 69.65,27.13 67.82,27.13 64.85,24.16 64.85,12.57 65.99,11.43 J7.6
N707
  Bottom 0.152: J7.7 69.8,12.65 69.8,14.33 70.41,14.94 70.41,23.85 72.16,25.6 72.16,26.14 IC7.6
N708
  Top 0.152: IC7.7 72.16,23.62 72.16,23.01 70.64,21.49 70.64,18.9 72.62,16.92 72.62,16.46 71.32,15.16 70.64,15.16 69.95,14.48 69.95,12.57 71.09,11.43 J7.8
N801  (via drill 0.3)
  Top 0.152: v64.39,43.89 53.34,43.89 51.82,42.37 51.82,32.38 v52.27,31.93 | v52.27,16.69 52.27,15.09 53.34,14.02 J8.1
  Bottom 0.152: v64.39,43.89 87.78,43.89 92.43,39.24 92.43,38.56 90.83,36.96 90.83,36.42 IC8.15 | v52.27,16.69 v52.27,31.93
N802  (via drill 0.3)
  Top 0.152: v82.07,42.67 82.07,41.83 83.13,40.77 83.13,38.94 IC8.1 | v55.32,43.36 v65.84,43.36 | v52.81,17.75 55.85,14.71 55.85,14.02 J8.2
  Bottom 0.152: v82.07,42.67 77.88,42.67 77.19,43.36 v65.84,43.36 | v55.32,43.36 53.65,41.68 53.65,31.01 52.81,30.18 v52.81,17.75
N803  (via drill 0.3)
  Top 0.152: v82.98,41.68 84.81,39.85 84.81,38.56 83.21,36.96 83.21,36.42 IC8.2 | v71.7,40.08 71.4,40.08 70.41,39.09 70.41,38.56 69.72,37.87 56.62,37.87 v55.17,36.42 | v55.17,31.32 55.17,17.22 J8.3
  Bottom 0.152: v82.98,41.68 78.26,41.68 76.66,40.08 v71.7,40.08 | v55.17,31.32 v55.17,36.42
N804  (via drill 0.3)
  Top 0.152: v66.29,9.91 76.81,9.91 85.42,18.52 85.42,20.57 85.72,20.88 85.72,24.46 85.42,24.77 85.42,26.82 85.19,27.05 85.19,29.11 84.81,29.49 84.81,31.62 83.21,33.22 83.21,33.76 IC8.3 | v65.15,9.07 64.16,9.07 62.18,11.05 62.18,12.72 60.96,13.95 J8.4
  Bottom 0.152: v66.29,9.91 65.99,9.91 v65.15,9.07
N805  (via drill 0.3)
  Top 0.152: v81.15,16.69 85.11,20.65 85.11,20.73 85.42,21.03 85.42,24.31 85.11,24.61 85.11,26.67 84.89,26.9 84.89,28.96 83.21,30.63 83.21,31.24 IC8.4 | v66.22,16.69 v72.08,16.69
  Bottom 0.152: v72.08,16.69 v81.15,16.69 | J8.5 v66.22,16.69
N806
  Top 0.152: J8.6 67.21,12.8 68.89,12.8 69.8,11.89 69.8,11.05 70.64,10.21 76.66,10.21 77.42,10.97 77.42,13.72 80.92,17.22 81.23,17.22 84.81,20.8 84.81,20.88 85.11,21.18 85.11,24.16 84.81,24.46 84.81,26.52 83.21,28.12 83.21,28.73 IC8.5
N807
  Bottom 0.152: J8.7 68.58,16.15 67.21,17.53 67.21,24 67.82,24.61 69.19,24.61 70.41,25.83 70.41,26.36 71.17,27.13 80.85,27.13 81.76,26.21 83.13,26.21 IC8.6
N808
  Top 0.152: IC8.7 83.13,23.62 81.76,23.62 80.16,22.02 78.79,22.02 71.17,14.4 71.17,14.02 J8.8
RCLK  (via drill 0.3)
  Top 0.152: IC5.12 57.84,28.8 59.28,28.8 60.12,29.64 67.97,29.64 68.81,28.8 IC6.12 | v75.97,28.8 79.78,28.8 IC7.12 | v85.72,28.8 v88.62,28.8 | v28.19,29.79 25.3,29.79 24.31,28.8 22.86,28.8 IC2.12 | v46.94,17.75 46.94,26.67 44.88,28.73 IC4.12 44.81,28.8 43.2,30.4 43.2,34.14 43.81,34.75 45.19,34.75 46.41,35.97 46.41,36.73 45.87,37.26 43.74,37.26 39.4,32.92 36.88,32.92 35.59,31.62 35.59,31.09 33.83,29.34 33.83,28.8 IC3.12 | v68.35,67.51 67.97,67.51 67.74,67.28 v63.17,67.28
  Bottom 0.152: v75.97,28.8 74.07,28.8 73.23,29.64 69.72,29.64 68.89,28.8 IC6.12 | v88.62,28.8 90.75,28.8 IC8.12 90.75,28.88 93.04,31.17 93.04,43.05 74.87,61.23 | v85.72,28.8 85.04,28.8 84.2,29.64 82.14,29.64 81.31,28.8 79.86,28.8 IC7.12 | 74.87,61.23 72.47,63.63 72.47,65.68 SV3.5 | v28.19,29.79 30.18,29.79 31.77,28.19 33.22,28.19 33.76,28.73 IC3.12 | v46.94,17.75 46.94,13.49 46.25,12.8 45.41,12.8 44.5,11.89 44.5,11.05 43.66,10.21 40.23,10.21 36.88,6.86 36.88,5.94 36.12,5.18 32.46,5.18 31.85,5.79 31.85,6.71 30.4,8.15 17.3,8.15 12.27,13.18 12.27,14.4 8.99,17.68 8.99,26.67 11.05,28.73 11.73,28.73 IC1.12 | IC4.12 44.88,28.8 46.41,30.33 46.41,60.27 41.45,65.23 41.45,66.14 41.99,66.67 42.82,66.67 43.74,65.76 44.96,65.76 SV2.5 44.96,65.84 45.95,66.83 45.95,68.12 47.7,69.88 60.27,69.88 62.87,67.28 v63.17,67.28 | 74.87,61.23 78.79,65.15 78.79,66.29 77.8,67.28 68.58,67.28 v68.35,67.51
RCLKOUT
  Bottom 0.152: SV1.5 17.53,65.68 17.53,63.7 20.19,61.04 20.19,60.2 21.03,59.36 22.71,59.36 23.93,60.58 U$2.P$9
SCLK  (via drill 0.3)
  Top 0.152: v73.61,25.3 69.72,25.3 68.89,26.14 IC6.11 | v86.26,26.14 v87.33,26.14 | v16.69,22.17 16.69,22.48 18.59,24.38 18.59,36.65 21.79,39.85 27.2,39.85 28.12,38.94 v28.12,32.08 29.03,31.17 29.03,29.18 28.8,28.96 v28.8,28.65 | v39.47,26.21 39.09,26.21 38.18,27.13 34.75,27.13 IC3.11
  Bottom 0.152: IC5.11 57.84,26.21 57.84,26.82 59.59,28.57 59.59,29.11 60.12,29.64 62.26,29.64 64.92,26.98 64.92,25.91 65.23,25.6 68.28,25.6 68.81,26.14 IC6.11 | v73.61,25.3 74.45,26.14 79.78,26.14 IC7.11 79.86,26.14 80.7,25.3 84.28,25.3 85.11,26.14 v86.26,26.14 | v87.33,26.14 89.23,26.14 | 89.23,26.14 90.75,26.14 IC8.11 | 68.77,69.38 69.88,68.28 SV3.4 | 68.77,69.38 67.89,70.26 45.57,70.26 43.59,68.28 42.44,68.28 SV2.4 42.37,68.2 42.37,67.51 41.15,66.29 41.15,62.94 43.05,61.04 43.05,60.2 44.88,58.37 44.88,47.7 42.98,45.8 42.98,43.97 41.38,42.37 41.38,26.21 | v16.69,22.17 11.35,22.17 10.21,23.32 10.21,24 11.73,25.53 11.73,26.14 IC1.11 | v28.12,32.08 28.12,31.24 26.52,29.64 25.15,29.64 24.38,28.88 24.38,27.74 22.86,26.21 IC2.11 | v28.8,28.65 31.24,26.21 33.76,26.21 IC3.11 | v39.47,26.21 41.38,26.21 | 41.38,26.21 44.81,26.21 IC4.11 | 89.23,26.14 89.23,23.24 89.76,22.71 91.82,22.71 93.34,24.23 93.34,51.13 79.1,65.38 79.1,68.05 76.35,70.79 70.18,70.79 68.77,69.38
SCLKOUT
  Bottom 0.152: SV1.4 14.94,68.28 16.08,68.28 17.07,69.27 17.83,69.27 19.05,68.05 19.05,67.82 20.19,66.67 20.42,66.67 21.57,65.53 21.57,65.3 26.21,60.66 26.52,60.66 U$2.P$10
SIN1
  Top 0.152: IC1.14 11.73,33.83 11.73,34.44 10.21,35.97 10.21,40.01 15.16,44.96 15.16,45.87 28.65,59.36 29.57,59.36 30.4,60.2 30.4,61.11 36.58,67.28 44.04,67.28 44.96,68.2 SV2.6
SIN2  (via drill 0.3)
  Top 0.152: v21.26,35.59 22.78,34.06 22.78,33.83 IC2.14 | v44.35,58.14 44.35,58.45 47.47,61.57 47.47,65.68 SV2.7
  Bottom 0.152: v21.26,35.59 21.26,39.32 26.06,44.12 29.57,44.12 30.4,44.96 30.4,45.87 42.67,58.14 v44.35,58.14
SIN3
  Top 0.152: IC3.14 33.83,33.83 33.83,34.44 35.59,36.2 35.59,40.01 40.54,44.96 40.54,55.09 46.56,61.11 46.56,67.28 47.47,68.2 SV2.8
SIN4
  Top 0.152: IC4.14 44.88,33.83 44.88,33.98 48.62,37.72 48.62,57.45 49.99,58.83 49.99,65.68 SV2.9
SIN5
  Bottom 0.152: IC5.14 57.76,33.83 57.76,34.44 56.16,36.04 56.16,60.81 51.05,65.91 51.05,67.21 50.06,68.2 SV2.10
SIN6
  Bottom 0.152: IC6.14 68.81,33.83 68.81,34.37 56.46,46.71 56.46,61.87 52.65,65.68 SV2.11
SIN7
  Top 0.152: IC7.14 79.78,33.83 79.78,34.44 53.57,60.66 53.57,67.28 52.65,68.2 SV2.12
SIN8
  Top 0.152: IC8.14 90.75,33.83 90.75,34.44 86.94,38.25 86.94,65.3 82.53,69.72 62.64,69.72 61.65,68.73 58.14,68.73 55.17,65.76 SV2.13
SOUT1
  Bottom 0.152: SV1.6 17.53,68.2 17.53,67.06 19.05,65.53 19.05,63.02 21.41,60.66 U$2.P$8
SOUT2
  Top 0.152: SV1.7 19.96,65.68 19.96,61.65 18.97,60.66 U$2.P$7
SOUT3
  Top 0.152: SV1.8 19.96,68.2 19.96,67.06 18.44,65.53 18.44,62.71 16.38,60.66 U$2.P$6
SOUT4
  Top 0.152: SV1.9 22.48,65.68 22.48,63.4 20.12,61.04 20.12,60.12 19.36,59.36 15.09,59.36 13.87,60.58 U$2.P$5
SOUT5
  Top 0.152: SV1.10 22.48,68.28 21.34,68.28 20.34,69.27 19.66,69.27 18.44,68.05 18.44,67.89 17.22,66.67 17.07,66.67 15.93,65.53 15.93,65.23 11.35,60.66 U$2.P$4
SOUT6
  Top 0.152: SV1.11 25.07,65.68 25.07,63.4 22.71,61.04 22.71,60.12 21.64,59.05 10.29,59.05 8.76,60.58 U$2.P$3
SOUT7
  Top 0.152: SV1.12 23.93,68.28 22.63,69.57 14.86,69.57 13.34,68.05 13.34,67.89 12.12,66.67 11.96,66.67 6.25,60.96 6.25,60.66 U$2.P$2
SOUT8
  Top 0.152: SV1.13 27.58,65.68 27.58,63.4 25.22,61.04 25.22,60.12 23.85,58.75 5.56,58.75 3.73,60.58 U$2.P$1
VCC
  Top 0.305: 49,69.34 52.96,69.34 54.1,68.2 54.1,65.3 54.71,64.69 66.37,64.69 67.36,65.68 SV3.1 | 49,69.34 47.09,69.34 46.48,68.73 46.48,68.35 45.34,67.21 44.96,67.21 43.89,66.14 43.89,65.76 42.82,64.69 41.99,64.69 41,65.68 39.93,65.68 SV2.1 | C5.1 52.73,41.99 55.78,38.94 57.76,38.94 IC5.16 57.91,38.94 59.21,38.94 61.27,41 62.71,41 63.63,41.91 C6.1 63.78,41.99 64.85,41.99 67.89,38.94 68.81,38.94 IC6.16 | C7.1 74.75,41.99 75.89,41.99 78.94,38.94 79.78,38.94 IC7.16 | IC1.16 11.81,38.94 14.86,41.99 17.68,41.99 C2.1 17.83,42.06 18.9,42.06 19.81,42.98 27.81,42.98 28.73,42.06 C3.1 | 42.29,40.54 43.89,38.94 44.81,38.94 IC4.16 | 42.29,40.54 40.84,41.99 39.78,41.99 C4.1 | J9.+ 14.25,15.01 14.25,18.14 18.97,22.86 18.97,35.74 22.1,38.86 22.78,38.86 IC2.16 | 49,69.34 49,60.27 49.61,59.66 49.61,59.05 45.64,55.09 45.64,43.89 42.29,40.54
  Bottom 0.305: IC8.16 90.75,38.94 89.92,38.94 86.87,41.99 85.8,41.99 C8.1 85.57,41.99 84.2,41.99 81.15,38.94 79.86,38.94 IC7.16 | IC6.16 68.89,38.94 72.62,42.67 74.07,42.67 74.68,42.06 C7.1 | SV3.1 67.36,65.68 67.36,47.78 63.78,44.2 63.78,42.06 C6.1 | IC1.16 11.73,38.94 11.73,39.55 9.3,41.99 C1.1 | SV1.1 12.34,65.68 7.32,65.68 3.58,61.95 3.2,61.95 2.36,61.11 2.36,44.88 3.81,43.43 16.31,43.43 17.68,42.06 C2.1 | IC2.16 22.86,38.94 24.16,38.94 27.2,41.99 28.73,41.99 C3.1 | C3.1 28.88,41.99 31.93,38.94 33.76,38.94 IC3.16 33.91,38.94 36.96,41.99 39.7,41.99 C4.1 | U$2.P$23 31.55,45.34 31.55,44.81 28.88,42.14 C3.1
XOUT1  (via drill 0.3)
  Top 0.152: v70.41,70.26 36.96,70.26 27.81,61.11 27.81,60.2 26.98,59.36 26.06,59.36 12.57,45.87 12.57,44.96 11.73,44.12 7.54,44.12 5.79,42.37 5.79,41.68 8.46,39.01 8.46,25.07 11.73,21.79 11.73,21.18 IC1.9
  Bottom 0.152: v70.41,70.26 72.39,68.28 SV3.6
XOUT2  (via drill 0.3)
  Top 0.152: v20.19,29.87 20.19,20.88 22.86,18.21 23.32,18.21 23.62,18.52 23.62,18.97 22.86,19.74 22.86,21.11 IC2.9 | v20.04,35.89 v20.04,34.37 | v61.87,69.72 v42.52,69.72
  Bottom 0.152: v20.19,29.87 20.19,34.21 v20.04,34.37 | v20.04,35.89 20.04,39.7 25.3,44.96 25.3,47.47 38.02,60.2 38.02,62.48 40.84,65.3 40.84,68.05 v42.52,69.72 | v61.87,69.72 64.54,69.72 67.28,66.98 77.65,66.98 78.49,66.14 78.49,65.3 77.95,64.77 75.97,64.77 75.06,65.68 SV3.7
XOUT3  (via drill 0.3)
  Top 0.152: v37.72,41.38 40.46,44.12 42.22,44.12 43.05,44.96 43.05,53.42 v49,59.36 | v55.63,59.36 64.92,59.36 71.48,65.91 71.48,66.14 72.62,67.28 74.07,67.28 74.98,68.2 SV3.8
  Bottom 0.152: v37.72,41.38 35.59,39.24 35.59,36.2 34.82,35.43 33.07,35.43 27.66,30.02 27.66,29.57 27.81,29.41 27.81,27.66 33.76,21.72 33.76,21.18 IC3.9 | v55.63,59.36 v49,59.36
XOUT4
  Bottom 0.152: IC4.9 44.88,21.18 44.88,21.79 48.31,25.22 48.31,65.15 49.07,65.91 49.07,68.66 49.68,69.27 59.97,69.27 63.09,66.14 66.45,66.14 66.98,66.67 76.58,66.67 77.5,65.76 SV3.9
XOUT5  (via drill 0.3)
  Top 0.152: v56.24,28.04 56.24,31.62 57.53,32.92 65.99,32.92 68.28,35.2 v69.65,35.2 | v72.92,42.06 72.92,62.26 76.58,65.91 76.58,67.28 77.5,68.2 SV3.10
  Bottom 0.152: v56.24,28.04 56.24,23.24 57.76,21.72 57.76,21.18 IC5.9 | v69.65,35.2 70.64,36.2 70.64,39.78 v72.92,42.06
XOUT6  (via drill 0.3)
  Top 0.152: v70.94,22.55 69.57,21.18 68.89,21.18 IC6.9 | v75.36,24.84 75.36,28.96 76.2,29.79 v81,29.79 | v85.34,30.33 85.34,41.07 81.84,44.58 81.84,63.93 80.09,65.68 SV3.11
  Bottom 0.152: v70.94,22.55 73.08,22.55 v75.36,24.84 | v81,29.79 81.84,29.79 82.37,30.33 v85.34,30.33
XOUT7
  Top 0.152: IC7.9 79.86,21.18 81.31,21.18 82.83,22.71 84.2,22.71 84.81,23.32 84.81,24 83.52,25.3 82.14,25.3 81.53,25.91 81.53,62.94 79.1,65.38 79.1,67.28 80.01,68.2 SV3.12
XOUT8
  Top 0.152: IC8.9 90.75,21.18 90.75,21.72 89.15,23.32 89.15,35.59 86.64,38.1 86.64,61.72 82.68,65.68 SV3.13

### Text on the board
tNames: MC1 | USB | Arduino Micro | Pineapple 128 Necobit Control Unit 1.0.0-X | DC5V1A | GND | 1 | 2 | 3 | 4 | 5 | 6 | 7 | 8 | G | G | 1 | 2 | 3 | 4 | 5 | 6 | 7 | 8 | G | G
bNames: OUT | IN | THRU